# EasyEDA Pro project ProProject_Tautek_ESP32S3_2024-01-15.epro, board PCB2
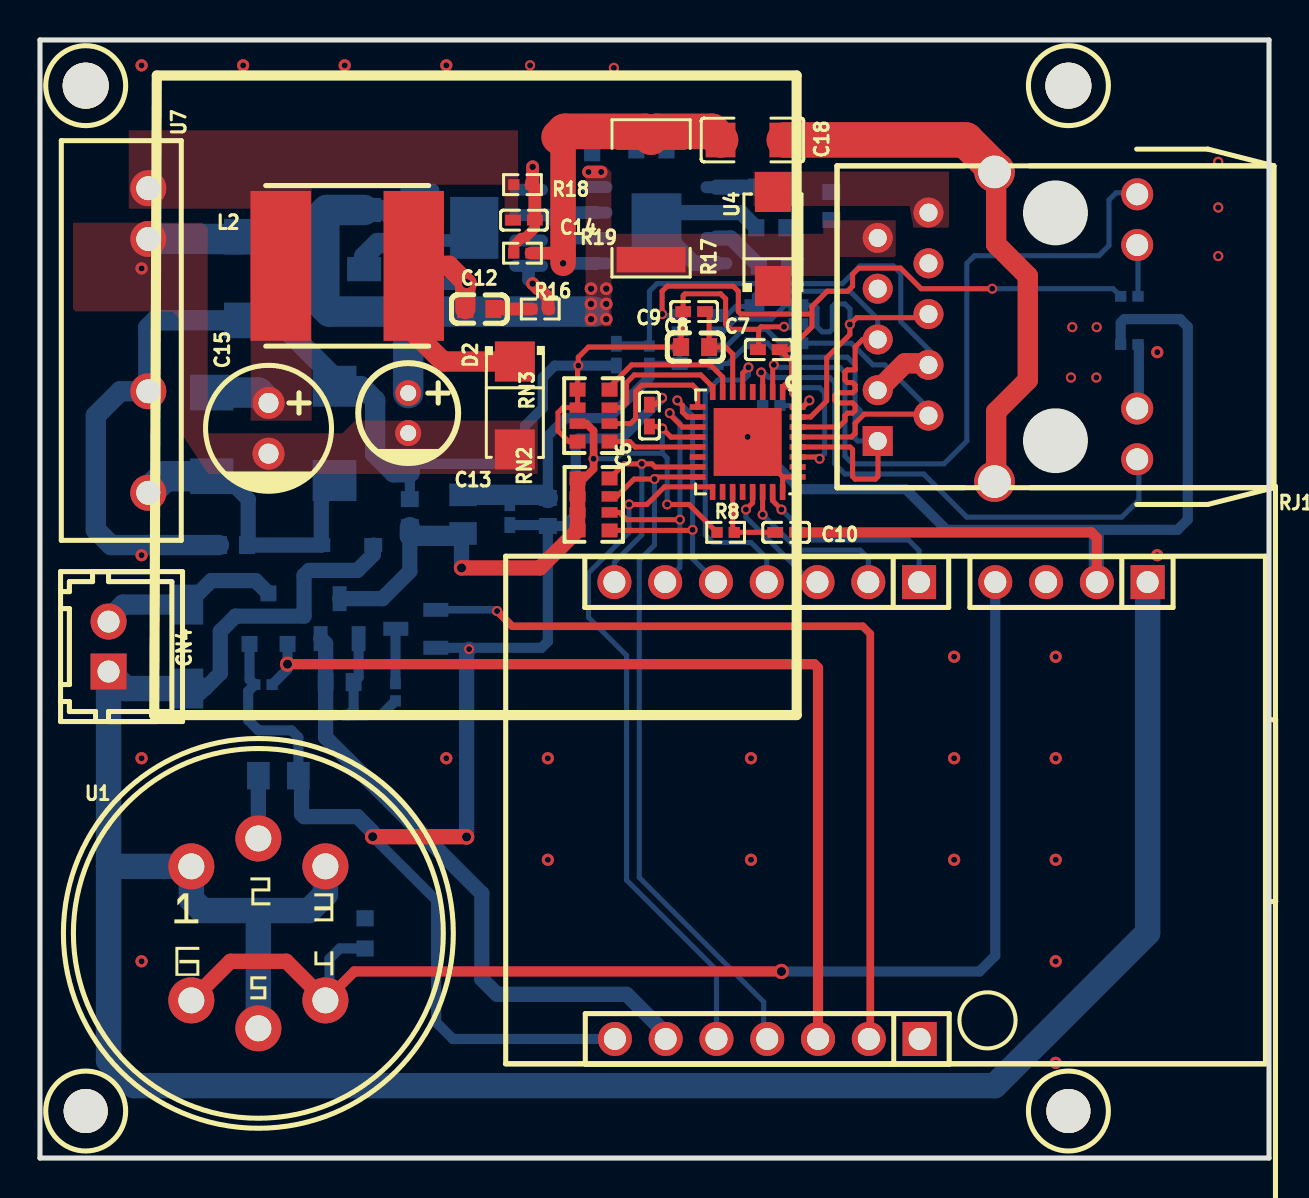
[diagram p2: board, top side]
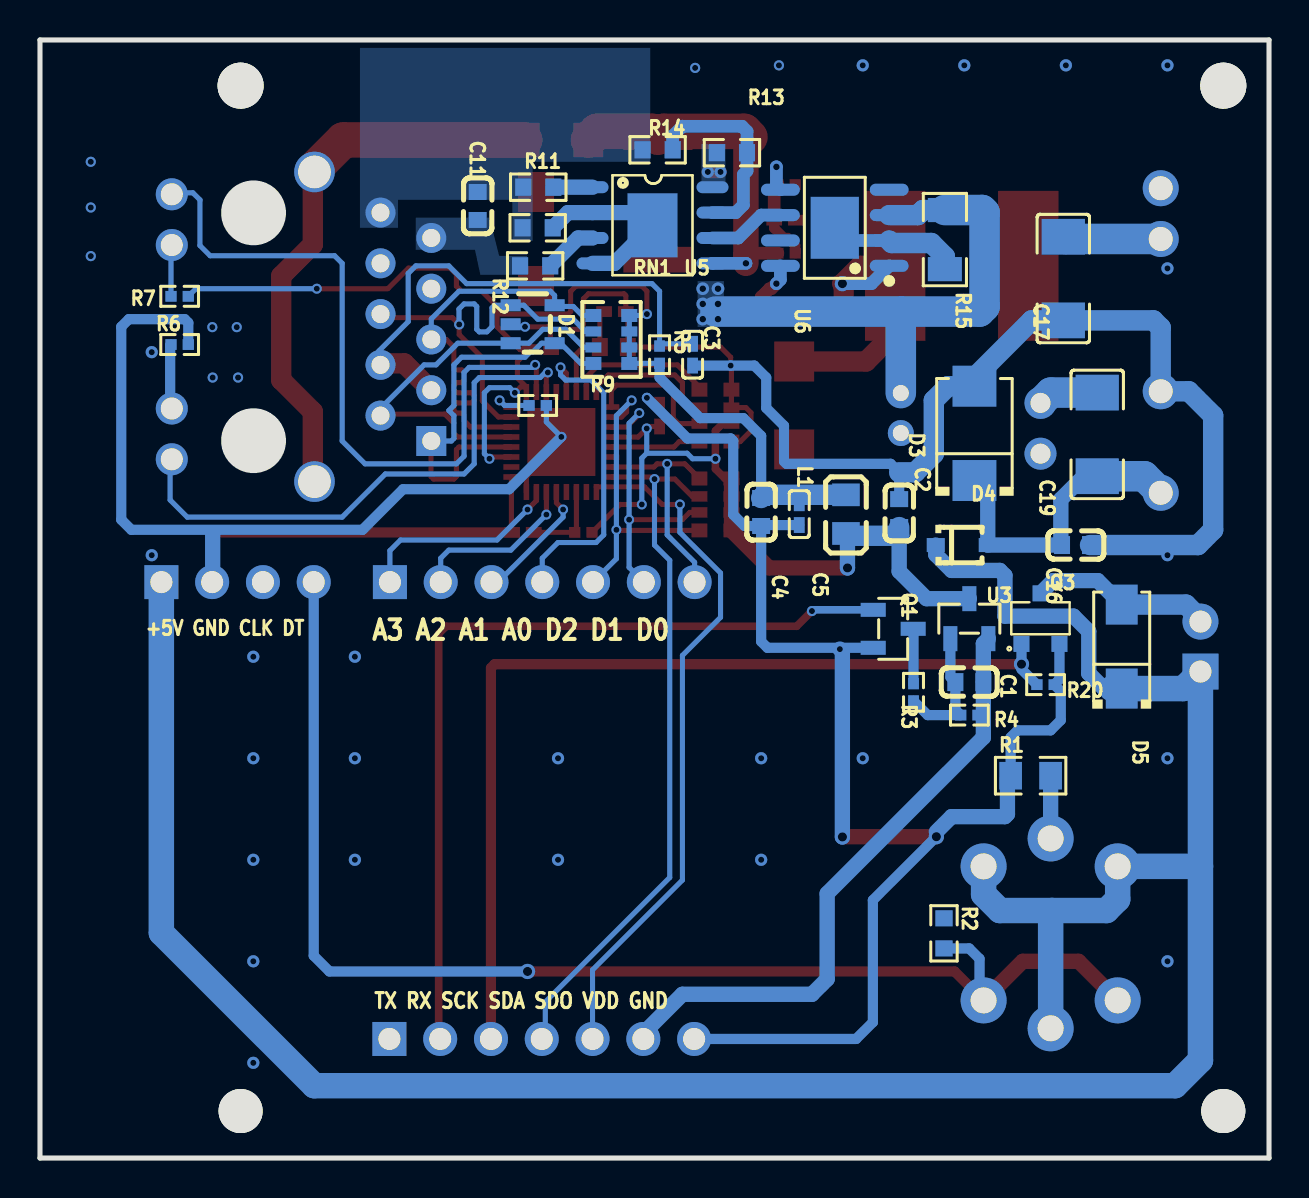
[diagram p3: board, bottom side, seen from below]

Outline 61.47 x 55.95 mm; copper layers: Top Layer, Bottom Layer. Coordinates in mm from the lower left corner of the outline.
Outline path: 0,55.95 61.47,55.95 61.47,0 0,0 0,55.95
Stack: Top Layer 0.035mm / Dielectric1 1.51mm FR4 er 4.5 / Bottom Layer 0.035mm

## Design rules (mm)
net TD-: DP1
net TD+: DP1
net RD-: DP2
net RD+: DP2
template: Custom Config
spacing copperThickness1oz (default): track to track 0.102, other pairs 0.152 to 0.3
spacing copperThickness2oz: track to track 0.203, other pairs 0.152 to 0.3
track width copperThickness1oz (default): min 0.127, default 0.254, max 2.54
track width copperThickness2oz: min 0.203, default 0.254, max 2.54
differential pair differentialPair (default): width min 0.127, default 0.254, max 2.54; gap min 0.152, default 0.152
via viaSize (default): diameter min 0.5, default 0.61, max 10; hole min 0.3, default 0.305, max 6.299

## Placement (name value [footprint] x y rotation side)
C1  22uF  [C0603]  14.99 23.81 180 bottom
C2  22uF  [C0603]  18.5 32.27 270 bottom
C3  100nF  [C0402]  28.83 40.2 90 bottom
C4  22uF  [C0603]  25.4 32.33 90 bottom
C5  100nF  [C0402]  23.5 32.22 90 bottom
C6  100nF  [C0402]  30.48 37.15 270 top
C7  100nF  [C0402]  36.45 40.45 180 top
C8  2.2uF  [C0603]  32.77 40.58 180 top
C9  100nF  [C0402]  32.71 42.36 180 top
C10  10uF  [C0402]  37.32 31.31 180 top
C11  100nF  [C0603]  39.58 47.64 270 bottom
C12  100nF  [C0603]  21.97 42.48 180 top
C13  15uF  [CAP-TH_BD5.0-P2.00-D0.8-FD]  18.41 37.28 270 top
C14  12pF  [C0402]  24.2 46.93 180 top
C15  470uF  [CAP-TH_BD6.3-P2.50-D1.0-FD]  11.43 36.51 270 top
C16  22uF  [C0603]  9.65 30.67 180 bottom
C17  1nF  [C1808]  10.29 44.01 90 bottom
C18  1nF  [C1206]  35.63 50.94 0 top
C19  1nF  [C1808]  8.59 36.21 90 bottom
CN4  ZX-XH2.54-2PZZ  [CONN-TH_2P-P2.50_HX25003-2A]  3.43 25.59 90 top
D1  ESDS314DBVR  [SOT-23-5_L2.9-W1.6-P0.95-LS2.8-BL]  36.83 41.72 270 bottom
D2  SS510  [SMA_L4.3-W2.6-LS5.2-RD]  23.75 37.66 270 top
D3  SMBJ6.0A  [SMB_L4.5-W3.7-LS5.4-RD]  14.73 36.26 90 bottom
D4  1N5819WS S4  [SOD-323_L1.6-W1.3-LS2.7-RD]  15.37 30.67 180 bottom
D5  1N4001  [SMA_L4.3-W2.5-LS5.0-RD]  7.37 25.59 90 bottom
H3  DZ254R-11-04-63  [HDR-TH_4P-P2.54-V-M]  51.59 28.82 180 top
H4  PZ254V-11-07P  [HDR-TH_7P-P2.54-V-M]  36.37 5.96 180 top
H5  PZ254V-11-07P  [HDR-TH_7P-P2.54-V-M]  36.35 28.82 180 top
L1  MPZ2012S601ATD25  [L0805]  21.16 32.22 90 bottom
L2  33uH  [IND-SMD_L8.0-W8.0]  15.37 44.64 0 top
NOREF  -  [Pad_e4700]  2.29 53.66 0 top
NOREF#2  -  [Pad_e4425]  51.44 53.66 0 top
NOREF#3  -  [Pad_e4432]  51.44 2.35 0 top
NOREF#4  -  [Pad_e4707]  2.29 2.35 0 top
Q1  LMUN2211LT1G  [SOT-23-3_L2.9-W1.3-P1.90-LS2.4-BR]  18.8 26.48 0 bottom
Q3  AO3406  [SOT-23-3L_L2.9-W1.6-P1.90-LS2.8-BL]  11.43 26.99 180 bottom
R1  5.1Ω  [R0805]  11.92 19.13 180 bottom
R2  1kΩ  [R0603]  16.26 11.24 270 bottom
R3  1kΩ  [R0402]  17.78 23.31 270 bottom
R4  10kΩ  [R0402]  14.99 22.16 180 bottom
R5  0Ω  [R0402]  30.48 40.2 270 bottom
R6  2.2kΩ  [R0402]  54.48 40.7 0 bottom
R7  2.2kΩ  [R0402]  54.48 43.12 180 bottom
R8  10kΩ  [R0402]  34.29 31.31 0 top
R9  12.1kΩ  [R0402]  36.58 37.66 0 bottom
R10  24.9kΩ  [R0603]  36.7 44.64 180 bottom
R11  180kΩ  [R0603]  36.55 48.58 180 bottom
R12  4.42kΩ  [R0603]  36.58 46.55 180 bottom
R13  130kΩ  [R0603]  26.86 50.31 0 bottom
R14  10kΩ  [R0603]  30.58 50.45 180 bottom
R15  30mΩ  [R1206]  16.21 45.96 270 bottom
R16  4.7Ω  [R0402]  25.02 42.48 180 top
R17  4.7kΩ  [R2512]  30.56 48.02 90 top
R18  56.2kΩ  [R0402]  24.13 48.71 180 top
R19  10.5kΩ  [R0402]  24.13 45.28 180 top
R20  10kΩ  [R0402]  11.18 23.69 0 bottom
RJ1  HY931147C  [RJ45-TH_HY931147C]  48.39 41.59 180 top
RN1  49.9Ω  [RES-ARRAY-SMD_0603-8P-L3.2-W1.6-BL]  32.89 40.96 270 bottom
RN2  2.2kΩ  [RES-ARRAY-SMD_8P-L3.2-W1.6-P0.80-BL-2]  27.69 32.7 270 top
RN3  2.2kΩ  [RES-ARRAY-SMD_8P-L3.2-W1.6-P0.80-BL-2]  27.69 37.15 90 top
U1  MQ-4  [SENSOR-TH_MQ-4]  10.92 11.24 0 top
U2  LAN8710A-EZC-TR  [QFN-32_L5.0-W5.0-P0.50-BL-EP3.4]  35.39 35.83 180 top
U3  WPM2015-3/TR  [SOT-23-3_L2.9-W1.3-P1.90-LS2.4-BR]  14.99 26.99 270 bottom
U4  SMAJ58A  [SMA_L4.3-W2.7-LS5.0-RD]  36.66 45.99 90 top
U5  TPS2376DDAR-H  [SO-8_L4.9-W3.9-P1.27-LS6.0-BL-EP]  30.83 46.67 270 bottom
U6  TX4138  [SOIC-8_L4.9-W3.9-P1.27-LS6.0-BL-EP]  21.72 46.55 90 bottom
U7  F0505S-2WR2  [PWRM-TH_FXXXXS-1WR2]  5.42 40.91 270 top

## Footprints (pads in the part's own frame, mm; a bottom-side part is the same pattern mirrored in y, then rotated)
C0402
  rect 0.79x0.54 smd: 1(-0.545,0) 2(0.545,0)
C0603
  rect 0.8x0.9 smd: 1(-0.7,0) 2(0.7,0)
C1206
  rect 1.485x1.728 smd: 1(-1.593,0) 2(1.593,0)
C1808
  rect 1.785x2.16 smd: 1(-2.092,0) 2(2.092,0)
CAP-TH_BD5.0-P2.00-D0.8-FD
  round 1.3 hole 0.8: 1(-1,0) 2(1,0)
CAP-TH_BD6.3-P2.50-D1.0-FD
  round 1.6 hole 1: 1(-1.27,0) 2(1.27,0)
CONN-TH_2P-P2.50_HX25003-2A
  rect 1.8x1.8 hole 1.1: 1(-1.25,0)
  round 1.8 hole 1.1: 2(1.25,0)
HDR-TH_4P-P2.54-V-M
  rect 1.7x1.7 hole 1.1: 1(-3.81,0)
  round 1.7 hole 1.1: 2(-1.27,0) 3(1.27,0) 4(3.81,0)
HDR-TH_7P-P2.54-V-M
  rect 1.7x1.7 hole 1.1: 1(-7.62,0)
  round 1.7 hole 1.1: 2(-5.08,0) 3(-2.54,0) 4(0,0) 5(2.54,0) 6(5.08,0) 7(7.62,0)
IND-SMD_L8.0-W8.0
  rect 3.024x7.5 smd: 1(3.328,0) 2(-3.328,0)
L0805
  rect 1.133x1.377 smd: 1(-0.966,0) 2(0.966,0)
Pad_e4425
  round 2.3 hole 2.6x2.3: 1(0,0)
Pad_e4432
  round 2.2 hole 2.6x2.2: 1(0,0)
Pad_e4700
  round 2.3 hole 2.3: 1(0,0)
Pad_e4707
  round 2.2 hole 2.2: 1(0,0)
PWRM-TH_FXXXXS-1WR2
  round 1.8 hole 1.2: 1(-7.62,0) 2(-5.08,0) 5(2.54,0) 7(7.62,0)
QFN-32_L5.0-W5.0-P0.50-BL-EP3.4
  rect 0.28x0.8 smd: 1(-1.75,-2.5) 2(-1.252,-2.5) 3(-0.751,-2.5) 4(-0.252,-2.5) 5(0.248,-2.5) 6(0.749,-2.5) 7(1.248,-2.5) 8(1.748,-2.5) 17(1.752,2.5) 18(1.252,2.5) 19(0.751,2.5) 20(0.252,2.5) 21(-0.248,2.5) 22(-0.749,2.5) 23(-1.248,2.5) 24(-1.748,2.5)
  rect 0.8x0.28 smd: 9(2.5,-1.748) 10(2.5,-1.248) 11(2.5,-0.748) 12(2.5,-0.248) 13(2.5,0.252) 14(2.5,0.752) 15(2.5,1.252) 16(2.5,1.752) 25(-2.5,1.75) 26(-2.5,1.25) 27(-2.5,0.75) 28(-2.5,0.25) 29(-2.5,-0.25) 30(-2.5,-0.75) 31(-2.5,-1.25) 32(-2.5,-1.75)
  rect 3.4x3.4 smd: 33(0,0)
R0402
  rect 0.566x0.54 smd: 1(-0.433,0) 2(0.433,0)
R0603
  rect 0.806x0.864 smd: 1(-0.753,0) 2(0.753,0)
R0805
  rect 1.133x1.377 smd: 1(-1,0) 2(1,0)
R1206
  rect 1.208x1.701 smd: 1(-1.479,0) 2(1.479,0)
R2512
  rect 1.282x3.456 smd: 1(-3.067,0) 2(3.067,0)
RES-ARRAY-SMD_8P-L3.2-W1.6-P0.80-BL-2
  rect 0.7x0.8 smd: 1(-1.3,-0.8) 4(1.3,-0.8) 5(1.3,0.8) 8(-1.3,0.8)
  rect 0.52x0.8 smd: 2(-0.4,-0.8) 3(0.4,-0.8) 6(0.4,0.8) 7(-0.4,0.8)
RES-ARRAY-SMD_0603-8P-L3.2-W1.6-BL
  rect 0.65x0.8 smd: 1(-1.2,-0.9) 4(1.2,-0.9) 5(1.2,0.9) 8(-1.2,0.9)
  rect 0.5x0.8 smd: 2(-0.4,-0.9) 3(0.4,-0.9) 6(0.4,0.9) 7(-0.4,0.9)
RJ45-TH_HY931147C
  rect 1.5x1.5 hole 0.9: 1(6.489,5.715)
  round 1.5 hole 0.9: 2(3.95,4.445) 3(6.489,3.175) 4(3.95,1.905) 5(6.489,0.635) 6(3.95,-0.635) 7(6.489,-1.905) 8(3.95,-3.175) 9(6.489,-4.445) 10(3.95,-5.715)
  round 1.6 hole 1.1: 11(-6.489,6.63) 12(-6.489,4.09) 13(-6.489,-4.09) 14(-6.489,-6.63)
  round 2.03 hole 1.631: GND1(0.647,7.747) GND2(0.647,-7.747)
SENSOR-TH_MQ-4
  round 2.3 hole 1.3: 1(-3.353,3.353) 2(0,4.75) 3(3.353,3.353) 4(3.353,-3.353) 5(0,-4.75) 6(-3.353,-3.353)
SMA_L4.3-W2.5-LS5.0-RD
  rect 2x1.593 smd: 1(-2.1,0) 2(2.1,0)
SMA_L4.3-W2.6-LS5.2-RD
  rect 2x2 smd: 1(-2.2,0) 2(2.2,0)
SMA_L4.3-W2.7-LS5.0-RD
  rect 2x1.8 smd: 1(-2.35,0) 2(2.35,0)
SMB_L4.5-W3.7-LS5.4-RD
  rect 2.047x2.192 smd: 1(-2.361,0) 2(2.361,0)
SO-8_L4.9-W3.9-P1.27-LS6.0-BL-EP
  oval 0.6x1.6 smd: 1(-1.905,-3) 2(-0.635,-3) 3(0.635,-3) 4(1.905,-3) 5(1.905,3) 6(0.635,3) 7(-0.635,3) 8(-1.905,3)
  rect 3.2x2.5 smd: 9(0,0)
SOD-323_L1.6-W1.3-LS2.7-RD
  rect 0.9x0.7 smd: 1(-1.3,0) 2(1.3,0)
SOIC-8_L4.9-W3.9-P1.27-LS6.0-BL-EP
  oval 0.602x1.941 smd: 1(-1.905,-2.72) 2(-0.635,-2.72) 3(0.635,-2.72) 4(1.905,-2.72) 5(1.905,2.72) 6(0.635,2.72) 7(-0.635,2.72) 8(-1.905,2.72)
  rect 3.098x2.41 smd: 9(0,0)
SOT-23-3_L2.9-W1.3-P1.90-LS2.4-BR
  rect 1.25x0.7 smd: 1(1,-0.95) 2(1,0.95) 3(-1,0)
SOT-23-3L_L2.9-W1.6-P1.90-LS2.8-BL
  rect 0.8x0.8 smd: 1(-0.95,-1.265) 2(0.95,-1.265) 3(0.005,1.265)
SOT-23-5_L2.9-W1.6-P0.95-LS2.8-BL
  rect 0.6x1 smd: 1(-0.95,-1.1) 2(0,-1.1) 3(0.95,-1.1) 4(0.95,1.1) 5(-0.95,1.1)

## Nets
As in the schematic, except:
FAN: H4.3 Q3.1 R20.2

Pads without a net: H4 1; NOREF 1; NOREF#2 1; NOREF#3 1; NOREF#4 1; RJ1 7 8; U2 4 14 18 20 26; U6 7

## Via types
v1: diameter 0.61, hole 0.305, Top Layer to Bottom Layer, 20 vias
v2: diameter 0.508, hole 0.305, Top Layer to Bottom Layer, 13 vias
v3: diameter 0.5, hole 0.3, Top Layer to Bottom Layer, 24 vias
v4: diameter 0.762, hole 0.457, Top Layer to Bottom Layer, 6 vias
v5: diameter 0.635, hole 0.33, Top Layer to Bottom Layer, 9 vias
v6: diameter 0.61, hole 0.304, Top Layer to Bottom Layer, 5 vias

## Routing (per net, layer and track width the routed paths; a pad name or vN(x,y) marks a point on that pad's centre or on a via; arc(x,y) is an arc through that point)
+3.3VLAN: length 36.8
  Top Layer w0.254: C6.2 31.03,36.6 v3(31.12,36.51) 31.55,36.08 U2.12 ; R8.1 32.46,32.7 v3(31.37,32.7)
  Top Layer w0.381: RN2.1 27.21,34 27.69,34.48 v2(27.69,34.99) 27.69,36.39 27.32,36.75 RN3.7
  Top Layer w0.762: v4(21.08,29.53) 25.01,29.53 26.89,31.4 RN2.3 RN2.1
  Bottom Layer w0.254: 31.12,35.27 v3(31.12,36.51) ; 31.12,35.27 31.37,35.02 v3(31.37,32.7) ; 31.12,35.27 29.1,35.27 28.83,34.99 v2(27.69,34.99)
  Bottom Layer w0.762: 18.5,31.13 18.5,29.36 17.13,27.99 U3.3 ; v4(21.08,29.53) 21.08,31.17
  Bottom Layer w1.016: C2.2 18.5,31.13 21.04,31.13 21.16,31.25
+3V3: length 31.3
  Bottom Layer w0.508: 14.29,22.12 14.51,22.12 R4.2
  Bottom Layer w0.762: U3.2 14.29,25.74 C1.2 14.29,21.05 22.1,13.23 22.1,8.95 22.86,8.19 29.34,8.19 31.29,6.24 H4.6
+5V_DCDC: length 3.1
  Bottom Layer w1.524: C15.1 10.91,38.3 C19.2
GND: length 214.9
  Top Layer w0.254: U2.24 37.14,34.08 ; v3(37.21,41.59) 36.07,41.59 35.94,41.47 ; v3(31.12,38.04) 30.77,37.69 30.73,37.69 ; RN3.8 26.45,35.85 25.91,36.39 25.91,37.3 26.16,37.55 RN3.6 RN3.5 26.89,39.61 v3(26.92,39.65) 26.92,40.07 27.43,40.58 C8.2 32.07,42.25 C9.2 32.17,43.16 32.26,43.25 34.04,43.25 34.29,42.99 34.29,41.72 34.54,41.47 35.94,41.47 ; U2.33 37.14,34.08 U2.25 37.89,31.34 C10.1 ; 35.94,41.47 35.94,40.49
  Top Layer w0.508: C10.1 52.58,31.31 52.86,31.03 H3.2
  Top Layer w0.762: v4(16.64,16.08) 21.32,16.08 v4(21.34,16.07)
  Bottom Layer w0.254: v3(37.21,41.59) 37.8,41.59 D1.2 ; R9.1 36.14,36.83 v3(35.39,36.08)
  Bottom Layer w0.508: v3(35.39,36.08) 38.01,33.47 43.31,33.47 45.34,31.43 56.9,31.43 57.4,31.94 57.4,41.59 57.02,41.97 54.23,41.97 54.05,41.8 R6.1 ; C4.1 25.35,31.67 C5.1 ; C4.1 25.4,25.85 25.09,25.53 Q1.2 ; C4.1 26.23,31.63 26.8,32.2 26.8,35.88 26.92,36.01 29.08,36.01 v3(31.12,38.04) ; C3.1 v3(26.92,39.65) 25.74,39.65 25.15,39.05 25.15,37.53 24.26,36.64 24.26,34.86 24.13,34.74 18.92,34.74 18.5,34.31 C2.1 ; v4(16.64,16.08) 19.81,12.9 19.81,6.8 20.65,5.96 H4.7 ; Q3.2 10.48,23.95 R20.1 10.41,23.36 10.41,21.91 10.92,21.4 12.57,21.4 12.92,21.05 R1.1
  Bottom Layer w0.762: H3.2 52.83,28.84 52.83,31.29 ; v3(21.46,25.47) 21.34,25.34 v4(21.34,16.07) ; 16.64,16.32 15.88,17.08 13.21,17.08 13.08,17.21 13.08,18.97 R1.1
  Bottom Layer w1.016: 14.99,38.62 16.05,38.62 16.76,37.91 16.76,35.24 17.7,34.31 18.5,34.31 ; 14.99,38.62 D3.2 ; 14.99,38.62 14.99,38.8 11.87,41.91 C17.1 5.78,41.91 5.42,41.55 U7.5 4.01,38.37 2.79,37.15 2.79,31.43 3.56,30.67 C16.2
  vias: v1(5.08,30.16) v1(5.08,20) v1(5.08,9.84) v1(20.32,20) v1(25.4,20) v1(25.4,14.92) v1(35.56,20) v1(35.56,14.92) v1(45.72,25.08) v1(45.72,20) v1(45.72,14.92) v1(50.8,25.08) v1(50.8,20) v1(50.8,14.92) v1(50.8,9.84) v1(50.8,4.76) v1(55.88,40.32) v1(55.88,30.16) v2(51.56,39.05) v2(51.63,41.58) v2(52.85,41.58) v2(52.83,39.05) v2(58.93,49.85) v2(58.93,47.56) v2(58.93,45.13)
GND1: length 23.2
  Top Layer w0.635: 26.16,45.19 26.08,45.28 R19.1
  Top Layer w1.27: v5(26.16,44.77) 26.16,50.89 25.96,51.09
  Top Layer w1.778: 25.96,51.09 26.25,51.37 30.27,51.37 R17.2 30.85,51.37 33.61,51.37 C18.1
  Bottom Layer w0.635: U5.5 27.83,44.77 v5(26.16,44.77)
  Bottom Layer w1.524: U7.2 10.17,45.99 C17.2
  vias: v2(24.51,54.67) v2(28.7,54.55) v6(5.08,54.67) v6(5.08,44.52) v6(10.16,54.67) v6(15.24,54.67) v6(20.32,54.67)
VCC: length 132.3
  Bottom Layer w0.762: D4.1 16.67,30.19 15.88,29.4 13.46,29.4 13.21,29.15 13.21,27.12 9.78,27.12 9.02,26.35 9.02,24.25 8.25,23.49 7.87,23.49
  Bottom Layer w1.27: 3.43,14.59 3.43,4.89 4.7,3.62 47.75,3.62 55.4,11.27 H3.1 ; 3.43,14.59 CN4.1 4.28,23.49 7.87,23.49 ; 3.43,14.59 U1.1 7.57,12.94 8.13,12.38 10.85,12.38 ; 10.85,12.38 13.46,12.38 14.28,13.2 U1.3 ; 10.85,12.38 10.92,12.31 U1.5
DATA: length 65.3
  Top Layer w0.508: v4(37.08,9.34) 15.72,9.34 U1.4
  Top Layer w0.762: U1.4 12.32,9.84 9.53,9.84 U1.6
  Bottom Layer w0.508: U1.4 14.48,8.09 14.48,9.97 14.99,10.49 15.9,10.49 ; H3.4 47.78,10.12 46.99,9.34 v4(37.08,9.34)
EMAC_CLK_OUT_180: length 15.9
  Top Layer w0.254: 35.14,38.58 35.14,39.27 v3(35.43,39.56)
  Bottom Layer w0.254: H5.4 36.35,30.01 35.56,30.8 33.66,30.8 33.27,31.18 33.27,38.29 33.91,38.93 35.18,38.93 35.43,39.18 v3(35.43,39.56)
EMAC_RX_CRS_DV: length 11.3
  Top Layer w0.254: U2.15 30.77,34.58 30.61,34.74 v3(30.1,34.74) 29.22,34.74 RN2.8
  Bottom Layer w0.254: v3(30.1,34.74) 30.1,31.18 28.73,29.81 H5.7
EMAC_RXD0: length 14.4
  Top Layer w0.254: v3(32,31.94) 29.34,31.94 28.97,32.3 RN2.6 ; U2.11 32.13,36.58 31.5,37.21 v3(31.5,37.28)
  Bottom Layer w0.254: H5.6 32,29.55 v3(32,31.94) 32,36.77 v3(31.5,37.28)
EMAC_RXD1: length 15.6
  Top Layer w0.254: v3(32.64,31.43) 32.61,31.4 28.49,31.4 ; U2.10 32.38,37.08 32.13,37.33 32.13,37.66 v3(31.88,37.91)
  Bottom Layer w0.254: H5.5 32.64,29.99 v3(32.64,31.43) 32.64,37.15 v3(31.88,37.91)
EMAC_TX_EN: length 6.6
  Top Layer w0.254: v3(35.31,32.45) 35.64,32.79 35.64,33.58
  Bottom Layer w0.254: v3(35.31,32.45) 35.31,32.07 38.56,28.82 H5.3
EMAC_TXD0: length 8.8
  Top Layer w0.254: 36.14,33.58 v3(36.14,32.2)
  Bottom Layer w0.254: v3(36.14,32.2) 37.92,30.42 41.02,30.42 41.43,30.01 H5.2
EMAC_TXD1: length 10.6
  Top Layer w0.254: v3(37.08,32.45) 36.64,32.89 36.64,33.58
  Bottom Layer w0.254: v3(37.08,32.45) 38.61,30.93 43.43,30.93 43.97,30.39 H5.1
FAN: length 47.5
  Top Layer w0.508: H4.3 38.91,24.53 38.73,24.71 v4(12.38,24.71)
  Bottom Layer w0.508: Q3.1 12.38,24.46 R20.2
ILIM: length 5.2
  Bottom Layer w0.635: U6.2 20.45,45.91
  Bottom Layer w1.016: U6.2 18.87,45.78 16.89,45.78 16.21,45.11 R15.2
LED1: length 27.5
  Top Layer w0.254: v3(36.07,39.31) 36.14,39.23 36.14,38.58
  Bottom Layer w0.254: v3(36.07,39.31) 36.19,39.31 36.45,39.05 39.5,39.05 39.75,38.8 39.75,34.74 40.26,34.23 44.2,34.23 46.35,32.07 54.1,32.07 54.96,32.93 54.96,35.04
LED2: length 36.1
  Top Layer w0.254: v3(36.7,39.69) 36.64,39.63 36.64,38.58
  Bottom Layer w0.254: 54.96,48.3 53.82,48.3 53.47,47.94 53.47,45.66 52.96,45.15 46.74,45.15 46.35,44.77 46.35,35.88 45.21,34.74 40.64,34.74 40.26,35.12 40.26,39.31 40,39.56 36.83,39.56 v3(36.7,39.69)
MDC: length 34.8
  Top Layer w0.254: 33.64,33.58 31.23,33.58 30.35,32.7 v3(29.46,32.7)
  Bottom Layer w0.254: v3(29.46,32.7) 29.46,31.31 27.43,29.28 27.43,27.05 29.34,25.15 29.34,13.91 33.83,9.41 H4.5
MDIO: length 35.8
  Top Layer w0.254: U2.16 30.84,34.08 v3(30.73,33.97) 29.72,33.97 28.85,33.1 28.49,33.1
  Bottom Layer w0.254: H4.4 36.19,6.14 36.19,7.81 29.97,14.03 29.97,29.91 30.73,30.67 v3(30.73,33.97)
PHY_PWR: length 42.5
  Top Layer w0.381: v2(22.86,27.37) 23.62,26.61 41.15,26.61 41.53,26.23 41.53,6.03 H4.2
  Bottom Layer w0.381: Q1.1 22.8,27.43 v2(22.86,27.37)
POE+: length 27.9
  Top Layer w0.635: v1(27.43,49.34) v1(28.07,49.34)
  Bottom Layer w1.016: R15.1 17.31,47.44 17.56,47.18 U6.3
  Bottom Layer w1.524: 27.69,42.36 18.37,42.36 ; 18.37,42.36 14.48,42.36 14.22,42.61 14.22,47.31 14.35,47.44 R15.1 ; 18.37,42.36 18.41,42.31 C13.1
  vias: v5(27.56,43.5) v5(27.56,42.74) v5(27.56,41.97) v5(28.32,43.5) v5(28.32,42.74) v5(28.32,41.97)
RD+: length 20.8
  Top Layer w0.254: U2.31 38.54,37.08 39.34,37.89 39.34,40.05 40.5,41.2 v2(40.5,41.71) 40.84,42.05 44.27,42.05 44.52,42.3
  Bottom Layer w0.254: RN1.2 34.18,41.36 34.8,41.97 36.58,41.97 37.27,42.67 D1.1 38.74,42.67 38.86,42.54 38.86,41.59 39.12,41.34 39.5,41.34 39.62,41.47 39.62,42.61 39.75,42.74 40.26,42.74 40.51,42.48 40.51,41.72
RD-: length 20.9
  Top Layer w0.254: RJ1.5 41.15,40.96 40.77,40.58 40.77,39.44 40.37,39.44 40.26,39.32 40.26,38.93 40.39,38.8 40.64,38.8 40.77,38.67 40.77,38.42 40.64,38.29 39.88,38.29 39.75,38.17 39.75,37.91 39.88,37.78 40.64,37.78 40.77,37.66 40.77,37.4 40.64,37.28 40.39,37.28 40.26,37.15 40.26,36.89 39.94,36.58 U2.30
  Bottom Layer w0.254: RN1.1 34.35,42.16 34.8,42.61 35.67,42.61 D1.5 35.73,43.16 35.94,43.37 40.51,43.37 41.9,41.99 RJ1.5
TD+: length 20.4
  Top Layer w0.254: U2.29 40.59,36.08 40.77,36.26 40.77,36.77 41.22,37.22 44.52,37.22
  Bottom Layer w0.254: RJ1.2 44.44,37.51 42.26,39.69 41.66,39.69 40.57,40.77 D1.3 37.02,40.77 36.32,41.47 35.18,41.47 34.27,40.56 RN1.3
TD-: length 20.3
  Top Layer w0.254: 41.98,35.95 41.91,35.89 41.91,34.1 41.78,33.97 40.77,33.97 40.64,34.1 40.64,35.45 40.51,35.58 U2.28
  Bottom Layer w0.254: RJ1.1 40.89,35.88 40.77,36.01 40.77,37.15 41.02,37.4 40.77,37.66 40.77,39.69 40.39,40.07 37.21,40.07 36.96,40.32 36.83,40.32 36.38,40.77 D1.4 35.43,40.77 34.42,39.76 RN1.4
$1N700: length 3.1
  Bottom Layer w0.762: R1.2 U1.2
$1N2202: length 6.7
  Bottom Layer w0.508: U3.1 15.94,24.06 15.69,23.81 15.69,22.43 R4.1 17.07,22.16 R3.2
$1N2225: length 2.7
  Bottom Layer w0.508: R3.1 17.78,26.47 Q1.3
$1N3053: length 25.9
  Top Layer w1.016: 41.98,38.49 43.25,39.76 44.52,39.76
  Bottom Layer w0.254: 44.52,39.76 44.52,40.38 43.05,41.85 43.05,44.26 42.67,44.64 41.02,44.64 40.13,43.75 30.86,43.75 30.48,43.37 R5.1 30.37,40.74 C3.2
$1N3553: length 4.8
  Top Layer w0.254: 33.26,42.36 33.47,42.15 33.47,40.58 34.29,40.58 34.64,40.22 34.64,38.58
$1N3828: length 3.1
  Bottom Layer w0.508: R6.2 54.96,40.66 54.96,37.58
$1N3966: length 58.7
  Top Layer w0.254: v3(38.99,34.99) 38.9,35.08 U2.27 ; 38.61,42.19 38.61,41.59 37.47,40.45 C7.1 37.59,39.85 37.59,39.03 37.14,38.58 37.43,38.58 v3(37.72,38.29) ; 38.61,42.19 38.61,42.61 39.37,43.37 40.39,43.37 40.64,43.63 40.64,44.22 40.95,44.53 43.04,44.53 44.07,43.5 v3(47.62,43.5) ; 38.61,42.19 38.56,42.23 35.05,42.23 34.93,42.36 34.93,43.37 34.67,43.63 31.37,43.63 31.12,43.37 v2(31.12,42.23)
  Bottom Layer w0.254: v3(47.62,43.5) 53.67,43.5 R7.2 ; R5.2 31.99,39.76 RN1.5 RN1.6 RN1.7 RN1.8 31.19,42.16 v2(31.12,42.23) ; v3(38.99,34.99) 39.24,35.24 39.24,38.29 38.99,38.55 37.97,38.55 v3(37.72,38.29)
  Bottom Layer w0.508: C4.2 25.4,36.13 26.29,37.02 28.45,37.02 30.48,39.05 R5.2
  Bottom Layer w1.016: C4.2 25.24,33.18 L1.2
$1N4011: length 2.7
  Bottom Layer w0.254: R7.1 54.92,45.72 54.96,45.76
$1N4990: length 4.4
  Top Layer w0.254: C10.2 34.85,31.31 34.72,31.43 ; R8.2 34.64,31.39 34.64,33.58
$1N5106: length 2.3
  Top Layer w0.254: U2.32 38.15,37.58 v3(38.48,37.91)
  Bottom Layer w0.254: v3(38.48,37.91) 38.23,37.66 R9.2
$1N5698: length 2
  Bottom Layer w0.762: U5.1 R11.2
$1N5818: length 2.7
  Bottom Layer w0.762: R10.2 34.56,46.04 U5.3
$1N5842: length 9.4
  Bottom Layer w0.762: R12.2 35.06,47.31 U5.2 31.47,47.31 U5.9 32.74,44.77 U5.4
$1N6036: length 10.2
  Bottom Layer w0.635: R14.2 29.83,51.14 29.34,51.63 26.36,51.63 26.11,51.37 R13.1 26.11,49.39 26.29,49.21 26.29,47.69 26.67,47.31 U5.7
$1N6047: length 3.9
  Bottom Layer w0.635: U5.6 26.54,46.04 25.4,47.18 U6.6
$1N7959: length 16
  Top Layer w1.016: D2.1 20.15,39.86 18.69,41.31 L2.1 20.45,44.64 v4(21.34,43.75) 21.27,43.69 C12.2
  Bottom Layer w0.635: v4(21.34,43.75) 19.89,43.75 U6.1
$1N7966: length 1.6
  Top Layer w0.635: 23.05,42.61 23.18,42.48 R16.2
$1N7969: length 2.6
  Top Layer w0.635: v5(24.64,43.75) 24.89,43.5 24.98,43.5 25.4,43.08 25.4,42.53 R16.1
  Bottom Layer w0.635: U6.8 24.44,43.95 v5(24.64,43.75)
$1N8334: length 6.2
  Top Layer w0.508: C14.1 24.75,46.53 24.26,46.04 24.08,46.04 23.7,45.66 R19.2
  Top Layer w0.635: v5(24.64,49.59) 24.64,48.78 R18.1 24.75,48.52 C14.1
  Bottom Layer w0.635: U6.5 24.64,48.65 v5(24.64,49.59)
$1N9216: length 28
  Top Layer w1.016: 47.82,33.92 47.82,37.34 49.4,38.93 49.4,44.13 47.82,45.72 47.82,49.42
  Top Layer w1.778: 47.82,49.42 46.3,50.94 37.22,50.94
$1N13735: length 15.5
  Bottom Layer w0.762: C19.1 9.26,34.12 10.41,32.96 10.41,30.73 C16.1 D4.2 14.07,32.98 14.99,33.9
  Bottom Layer w1.524: C19.1 6.24,34.12 U7.7
$1N21641: length 6.9
  Top Layer w0.254: 34.14,38.58 34.14,39.07 33.53,39.69 29.59,39.69 28.45,38.55
$1N21648: length 6.7
  Top Layer w0.254: RN3.3 29.1,37.55 29.34,37.78 29.34,38.8 29.72,39.18 33.05,39.18 33.64,38.58
$1N21654: length 6.9
  Top Layer w0.254: U2.9 32.89,38.42 32.64,38.67 30.1,38.67 29.79,38.37 29.79,37 29.54,36.75 RN3.2
$1N21658: length 4.5
  Top Layer w0.254: RN3.1 29.49,35.85 29.77,35.58 U2.13
$1N29376: length 9.2
  Bottom Layer w0.762: Q3.3 10.78,28.89 8.57,28.89 D5.2
  Bottom Layer w1.016: 3.3,26.84 4.15,27.69 D5.2

## Copper pours and planes (outline as drawn; the poured copper is in the pictures)
+5V_DCDC on Top Layer: 4.45,51.42 23.9,51.42 23.9,36.9 4.45,36.9
GND on Top Layer: 50.8,42.82 50.8,55.9 61.47,55.95 61.47,42.86 50.93,42.86
GND on Top Layer: 6.35,39.49 6.35,32.32 25.65,32.32 25.78,32.45 25.78,40.92 29.56,40.92 29.59,40.96 29.59,43.37 61.47,43.37 61.47,-0.19 61.59,-0.32 0,-0.32 0,39.49
GND on Bottom Layer: 0,43 11.76,43 13.97,40.79 17.27,40.79 17.27,34.99 19.68,34.99 19.93,34.74 19.93,40.78 61.47,40.78 61.47,0.5 0,0.5
GND on Bottom Layer: 46.86,55.94 61.47,55.95 61.47,40.58 61.59,40.45 46.99,40.45 46.86,40.58
GND1 on Top Layer: 0,55.95 0,42.36 0.13,42.23 7.49,42.23 7.49,33.85 24.89,33.85 24.89,41.97 26.71,41.97 26.71,50.15 26.8,50.23 49.15,50.23 49.15,55.95
GND1 on Top Layer: 1.65,46.8 24.89,46.8 24.89,34.23 1.65,34.23
GND1 on Bottom Layer: 23.18,55.95 30.09,55.95 30.09,52.41 23.39,52.41 23.11,52.14 23.11,55.88
GND1 on Bottom Layer: 0,55.95 23.7,55.95 23.7,44.69 23.88,44.52 0,44.52
POE+ on Top Layer: 27.28,44.46 28.57,44.46 28.57,41.61 27.28,41.61
POE+ on Top Layer: 27.29,49.64 42.8,49.64 42.8,44.13 27.29,44.13
POE+ on Bottom Layer: 37.11,47.06 42.67,47.06 42.67,44.19 37.11,44.19
POE+ on Bottom Layer: 27.18,50.74 28.38,50.74 28.38,48.56 27.18,48.56
POE+ on Bottom Layer: 27.26,43.88 28.57,43.88 28.57,41.58 27.26,41.58
POE- on Top Layer: 35.69,49.36 45.47,49.36 45.47,46.55 35.69,46.55
POE- on Bottom Layer: 30.95,55.55 45.47,55.55 45.47,45.89 30.95,45.89

## Text on the board
Bottom Silkscreen Layer: +5V GND CLK DT | TX RX SCK SDA SDO VDD GND | A3 A2 A1 A0 D2 D1 D0
